# EAGLE design SwitchDemoFeatherPTH (EAGLE 9.4.0)
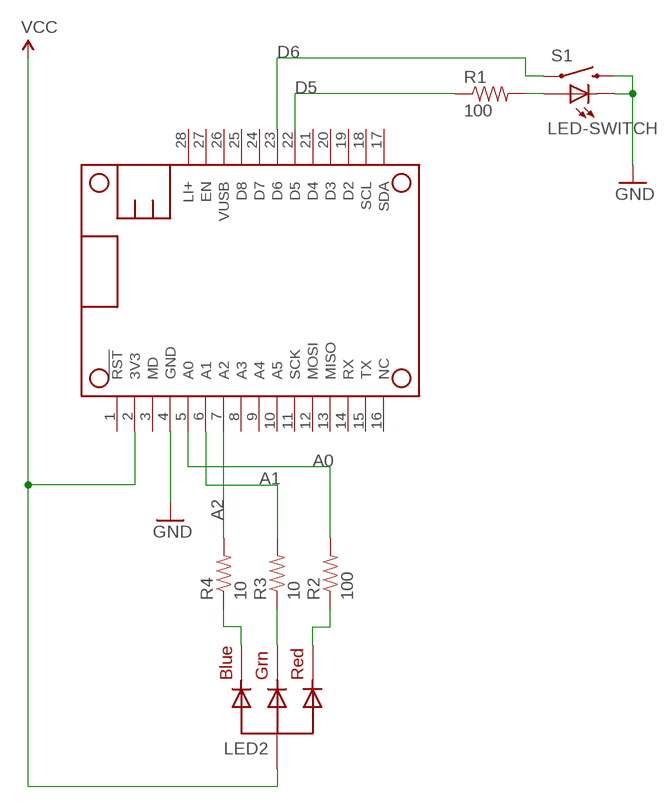
[diagram p0: schematic, sheet 1]

## Parts
LED2  RGBLED_CA-5MM  [LED5MMRGB]
MS1  PARTICLE_MESH_NODIM  [FEATHERWING_NODIM]
R1  100  1KOHM-1/4W-5%(PTH)  [AXIAL-0.3]
R2  100  1KOHM-1/4W-5%(PTH)  [AXIAL-0.3]
R3  10  1KOHM-1/4W-5%(PTH)  [AXIAL-0.3]
R4  10  1KOHM-1/4W-5%(PTH)  [AXIAL-0.3]
S1  LED-SWITCH  SWITCH-MOMENTARY-LEDPTH  [TACTILE-PTH-LED-12MM]

## Nets
3V3: LED2.2(VCC) MS1.2(3V3) ; supply symbol labelled VCC
A0: MS1.5(A0) R2.P$2
A1: MS1.6(A1) R3.P$2
A2: MS1.7(A2) R4.P$2
D5: MS1.22(D5) R1.P$1
D6: MS1.23(D6) S1.4
GND: MS1.4(GND) S1.2 S1.C
N$1: LED2.3(GREEN) R3.P$1
N$2: LED2.4(BLUE) R4.P$1
N$3: R1.P$2 S1.A
N$4: LED2.1(RED) R2.P$1
Unconnected: MS1.1(!RST) MS1.3(MD) MS1.8(A3) MS1.9(A4) MS1.10(A5) MS1.11(SCK) MS1.12(MOSI) MS1.13(MISO) MS1.14(RX) MS1.15(TX) MS1.16(NC) MS1.17(SDA) MS1.18(SCL) MS1.19(D2) MS1.20(D3) MS1.21(D4) MS1.24(D7) MS1.25(D8) MS1.26(VUSB) MS1.27(EN) MS1.28(LI+)

## Library data of the parts
LED2 = adafruit:RGBLED_CA: RGB LED, common-anode 5MM Staggered pins 5mm Piranha package http://www.ladyada.net/library/pcb/eaglelibrary.html
MS1 = rickk2:PARTICLE_MESH
R1-R4 = SparkFun-Resistors:1KOHM-1/4W-5%(PTH): RES-08380; PROD_ID: RES-08380; VALE: 1k
S1 = SparkFun-Electromechanical:SWITCH-MOMENTARY-LED: EZ is for Kits. There is no tStop (covering up the top side of the pads with mask). This helps the beginner see which side they should be soldering too.

## Board
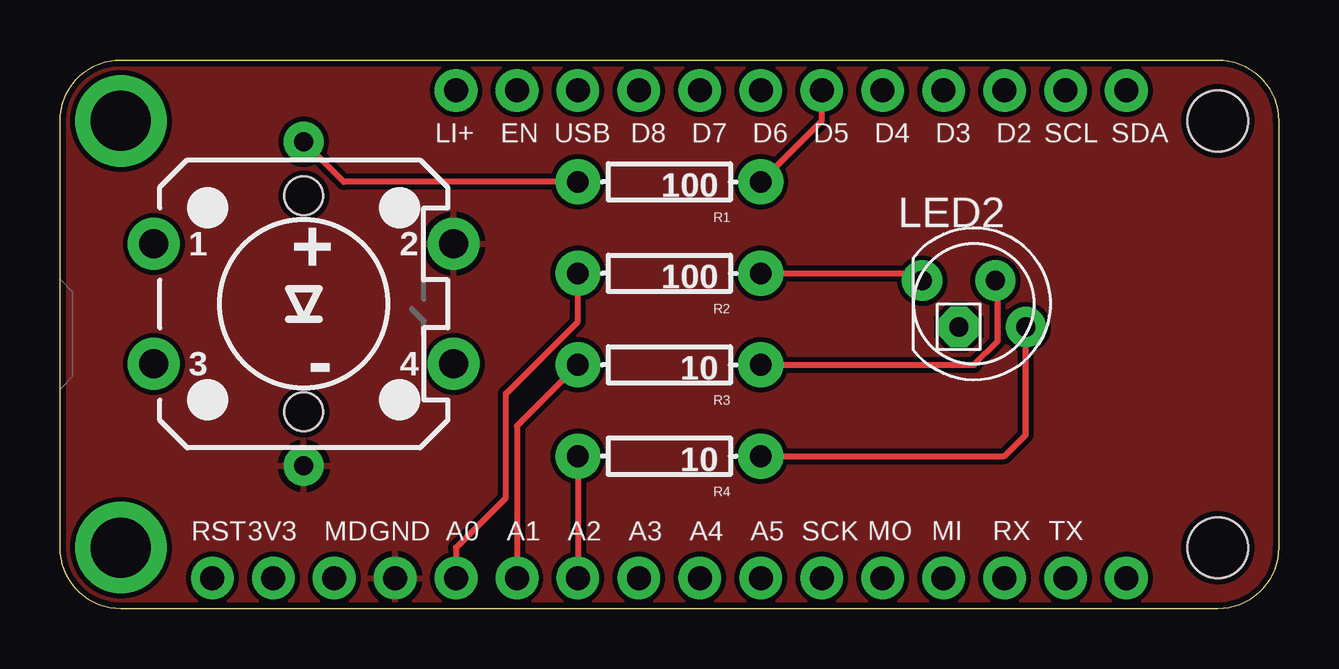
[diagram p1: board, top side]
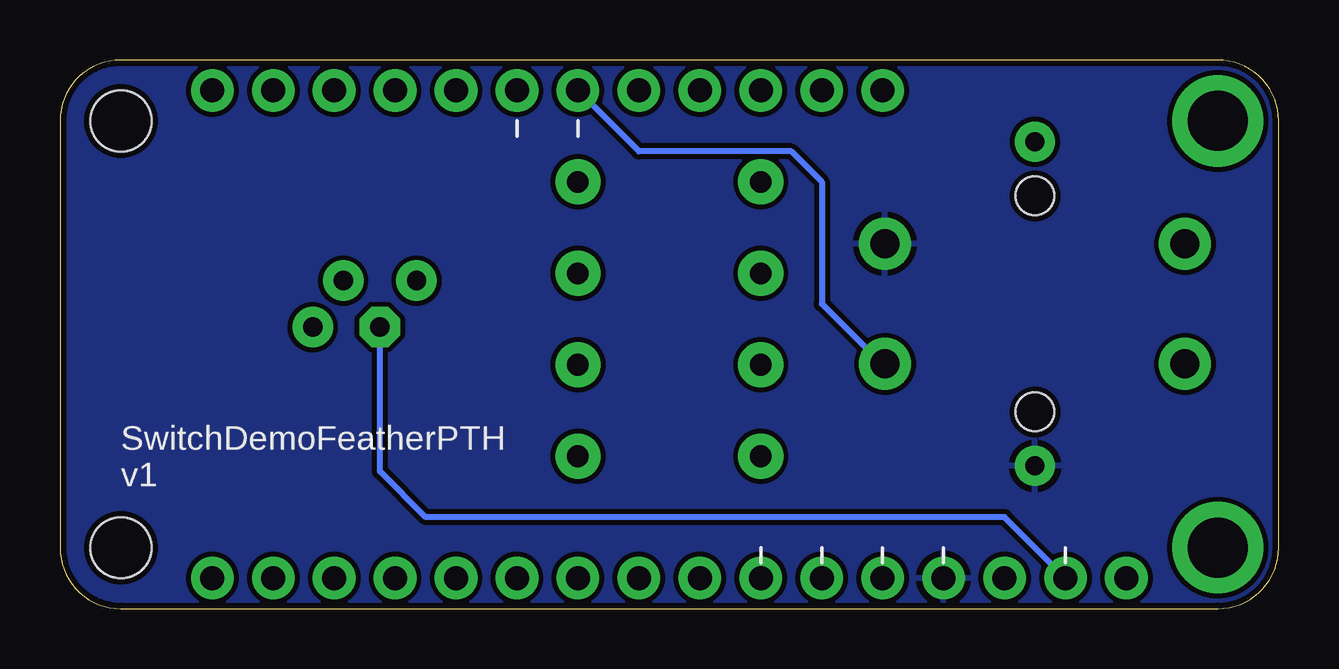
[diagram p2: board, bottom side, seen from below]

Size 50.8 x 22.86 mm. Coordinates in mm from the lower left corner, seen from the top.
Outline: 2.54,22.86 48.26,22.86 arc-90 50.8,20.32 50.8,2.54 arc-90 48.26,0 2.54,0 arc-90 0,2.54 0,20.32 arc-90 2.54,22.86
Copper layers (1*16): Top 0.035mm / dielectric 1.5mm / Bottom 0.035mm
Design rules "adafruit": minimum track width 8mil, minimum drill 15.5mil, track to track 8mil, track to pad 8mil, pad to pad 8mil, via to via 8mil, smd to smd 8mil, copper to edge 10mil, drill to drill 8mil, minimum pad ring 10mil, minimum via ring 8mil, stop-mask expansion 2mil, vias tented up to drill 20mil, thermal gap 10mil

### Footprints (pad centres in the part's own frame; a part is rotated, then mirrored left to right if it is on the bottom)
LED5MMRGB = drill 0.8 pad 1.676: 1 -2.159,0.968; 3 0.889,0.968; 4 2.159,-0.968 | drill 0.8 pad 1.676 octagon: 2 -0.635,-0.968
FEATHERWING_NODIM = drill 1 pad 1.778: 1 6.35,1.27; 2 8.89,1.27; 3 11.43,1.27; 4 13.97,1.27; 5 16.51,1.27; 6 19.05,1.27; 7 21.59,1.27; 8 24.13,1.27; 9 26.67,1.27; 10 29.21,1.27; 11 31.75,1.27; 12 34.29,1.27; 13 36.83,1.27; 14 39.37,1.27; 15 41.91,1.27; 16 44.45,1.27; 17 44.45,21.59; 18 41.91,21.59; 19 39.37,21.59; 20 36.83,21.59; 21 34.29,21.59; 22 31.75,21.59; 23 29.21,21.59; 24 26.67,21.59; 25 24.13,21.59; 26 21.59,21.59; 27 19.05,21.59; 28 16.51,21.59 | drill 2.5 pad 3.81: P$1 2.54,20.32; P$2 2.54,2.54 | hole 2.54: 48.26,20.32; 48.26,2.54
AXIAL-0.3 = drill 0.9 pad 1.88: P$1 -3.81,0; P$2 3.81,0
TACTILE-PTH-LED-12MM = drill 1.2 pad 2.159: 1 -6.25,2.5; 2 6.25,2.5; 3 -6.25,-2.5; 4 6.25,-2.5 | drill 0.8 pad 1.676: A 0,6.75; C 0,-6.75 | hole 1.6: 0,4.5; 0,-4.5

### Placement (x,y rotation side)
LED2  38.1,12.7 0 top
MS1  0,0 0 top
R1  25.4,17.78 180 top
R2  25.4,13.97 180 top
R3  25.4,10.16 180 top
R4  25.4,6.35 180 top
S1  10.16,12.7 0 top

### Tracks (layer width: path | path; a pad name or v marks a point on that pad's centre or on a via)
3V3
  Bottom 0.254: LED2.2 37.47,5.71 35.56,3.81 11.43,3.81 MS1.2
A0
  Top 0.254: R2.P$2 21.59,11.96 18.59,8.96 18.59,4.62 16.51,2.54 MS1.5
A1
  Top 0.254: R3.P$2 19.05,7.62 MS1.6
A2
  Top 0.254: R4.P$2 MS1.7
D5
  Top 0.254: R1.P$1 31.75,20.32 MS1.22
D6
  Bottom 0.254: S1.4 16.55,10.2 19.05,12.7 19.05,17.78 20.32,19.05 26.67,19.05 MS1.23
GND
  pour Top: 0,0 0,22.86 50.8,22.86 50.8,0
  pour Bottom: 0,0 0,22.86 50.8,22.86 50.8,0
N$1
  Top 0.254: R3.P$1 38.1,10.16 39.09,11.15 39.09,13.57 LED2.3
N$2
  Top 0.254: R4.P$1 39.37,6.35 40.26,7.24 LED2.4
N$3
  Top 0.254: R1.P$2 11.83,17.78 S1.A
N$4
  Top 0.254: R2.P$1 35.64,13.97 LED2.1

### Text on the board
tPlace: LI+ | EN | USB | D8 | D7 | D6 | D5 | D4 | D3 | D2 | SCL | SDA | RST | 3V3 | MD | GND | A0 | A1 | A2 | A3 | A4 | A5 | SCK | MO | MI | RX | TX
bPlace: SwitchDemoFeatherPTH / v1